# EasyEDA Pro project ReuseBlock_1_2024-11-17.epro

# Schematic 1
Create Date: 2024-03-08; Page Name: P1; Project Name: STC32F12K54母版; Schematic Name: Schematic3; Update Date: 2024-03-19; Company: 嘉立创EDA; Page Size: A4; Version: V1.0
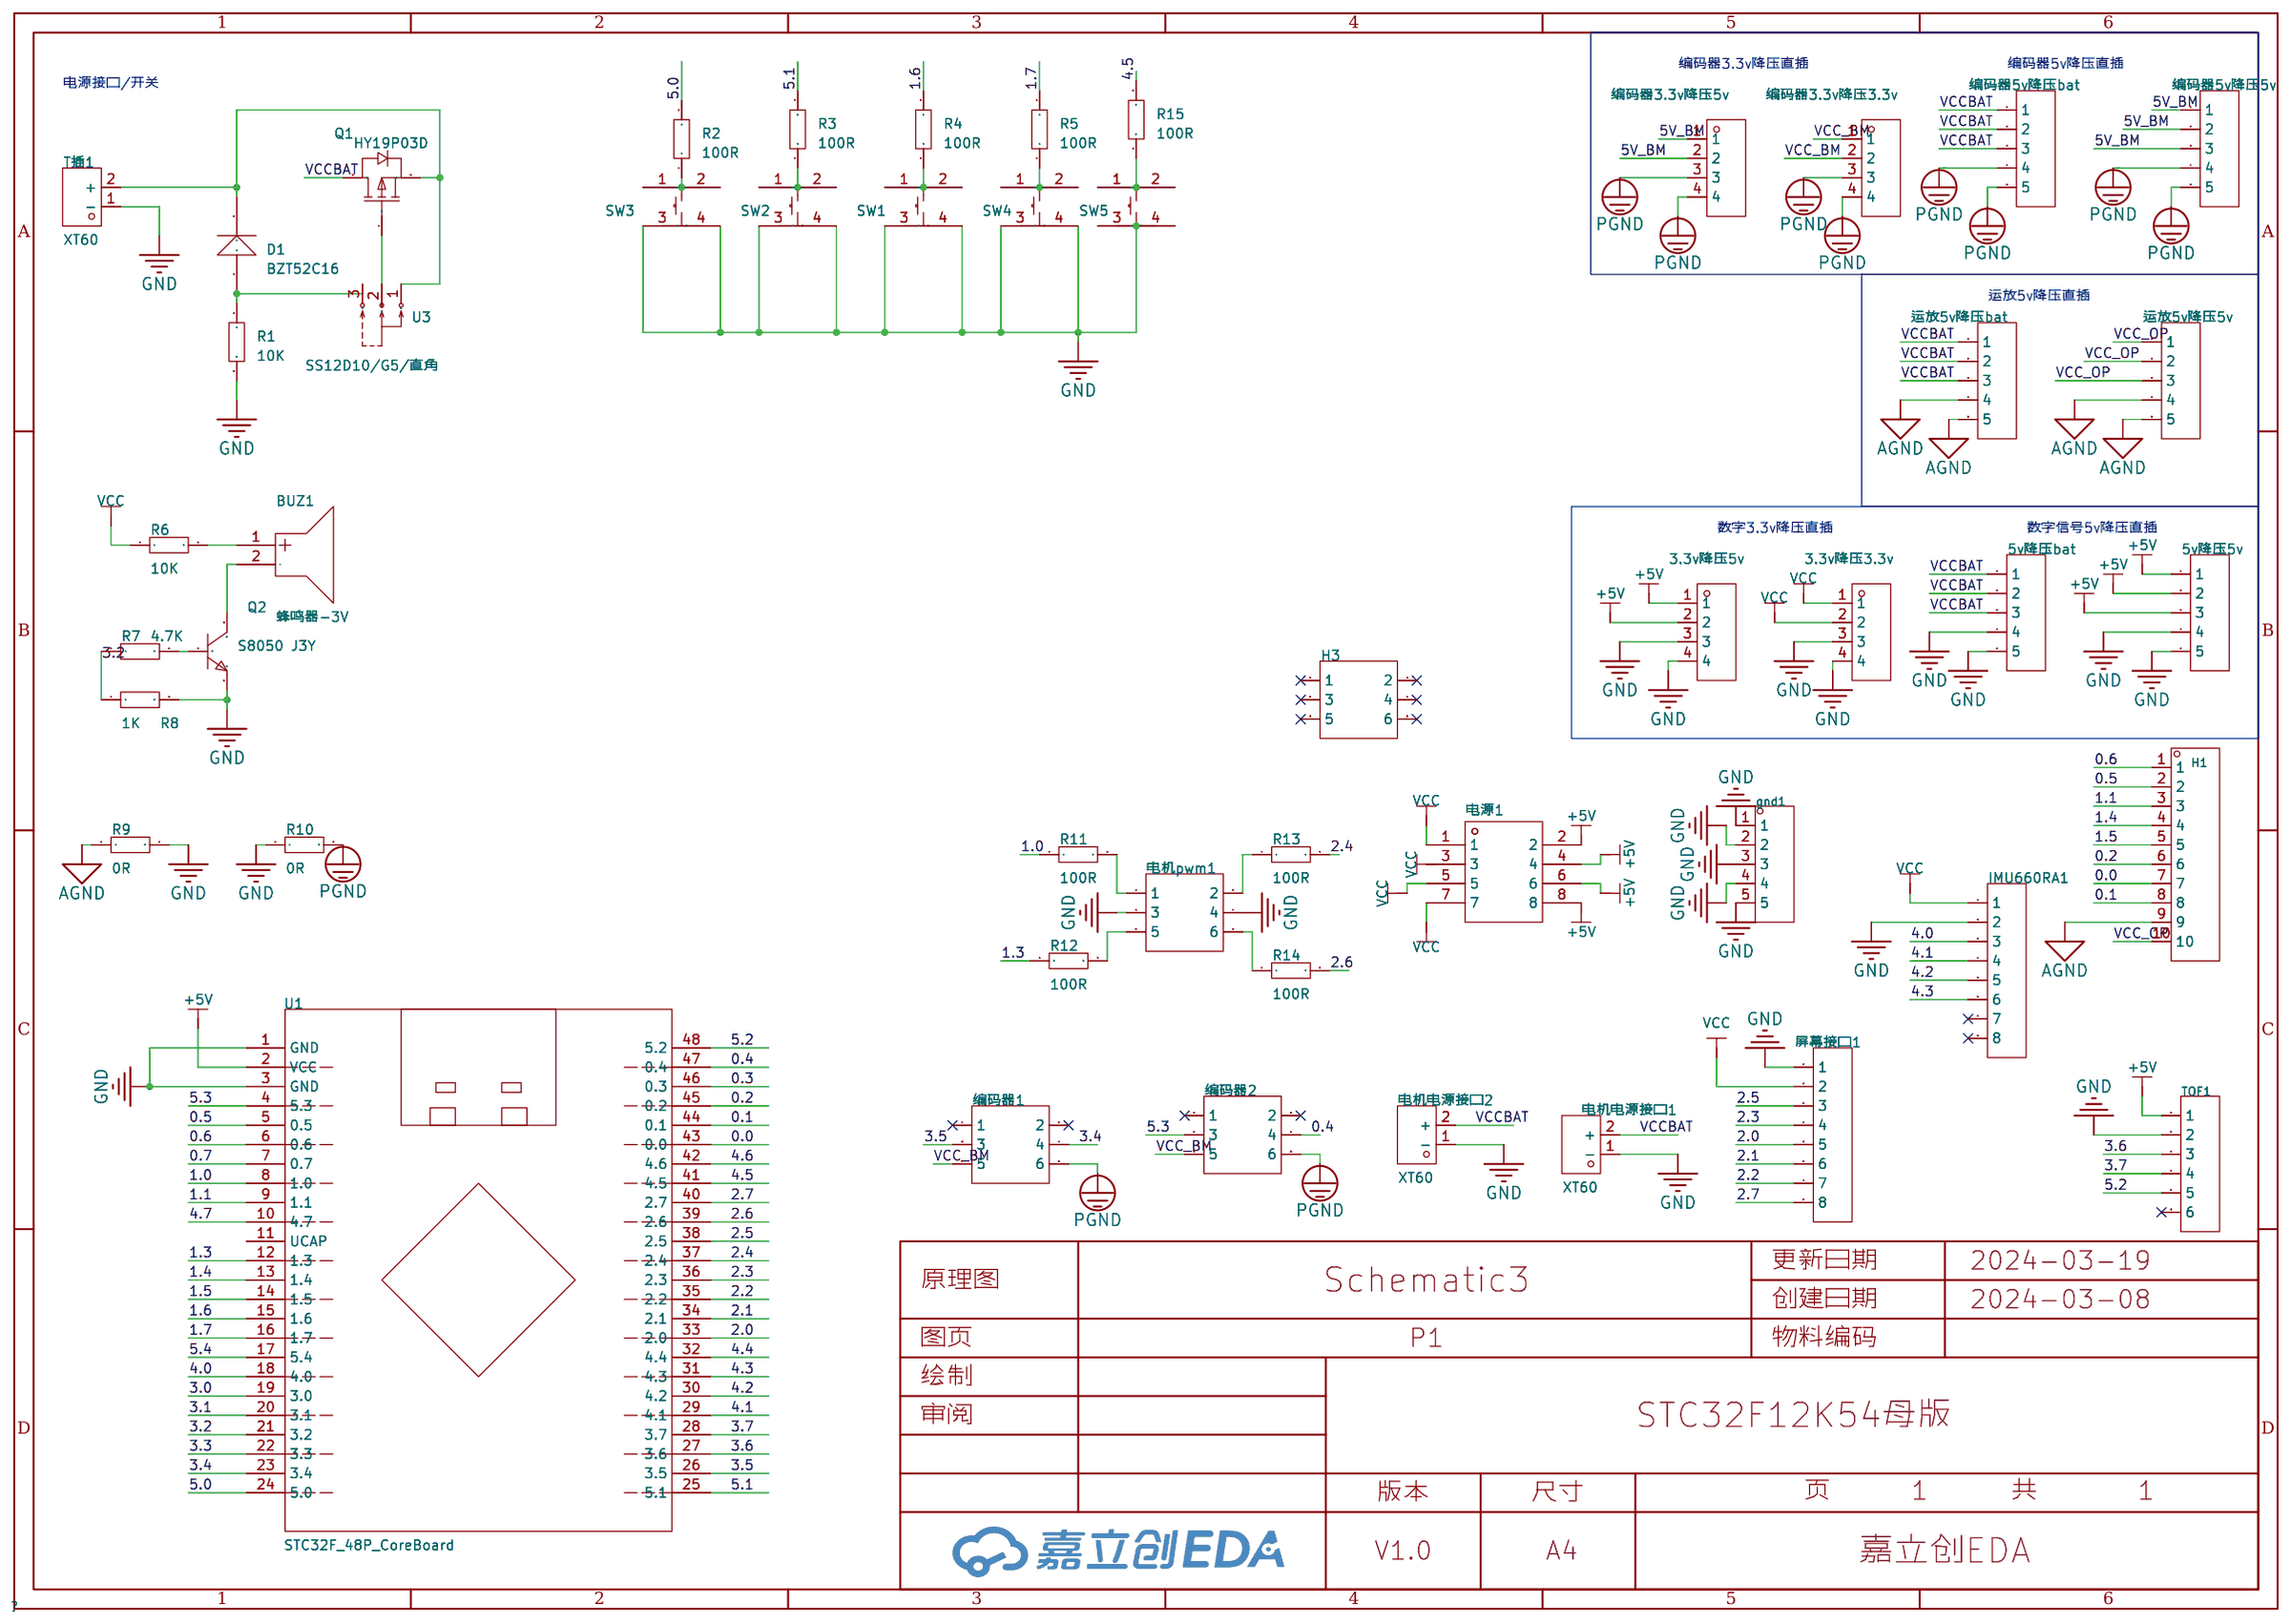
[diagram p0: schematic sheet]

## Parts
3.3v降压3.3v  -  [HDR-TH_4P-P2.54-V-F]
3.3v降压5v  -  [HDR-TH_4P-P2.54-V-F]
5v降压5v  -  [HDR-TH_5P-P2.54-V-F]
5v降压bat  -  [HDR-TH_5P-P2.54-V-F]
BUZ1  蜂鸣器-3V  [BUZ-TH_BD12.0-P7.60-D0.6-FD]
D1  BZT52C16  [SS14]
gnd1  -  [HDR-TH_5P-P2.54-V-M]
H1  -  [HDR-TH_10P-P2.54-V-M-1]
H3  -  [HDR-TH_6P-P2.54-V-R2-C3-S2.54_A2541WV-2X3P]
IMU660RA1  -  [HDR-TH_8P-P2.54-V-F-1]
Q1  HY19P03D  [TO-252-3_L6.5-W5.8-P4.58-BL]
Q2  S8050 J3Y  [SOT-23-3_L3.0-W1.7-P0.95-LS2.9-BR]
R1  10K  [R0603]
R2  100R  [R0603]
R3  100R  [R0603]
R4  100R  [R0603]
R5  100R  [R0603]
R6  10K  [R0603]
R7  4.7K  [R0603]
R8  1K  [R0603]
R9  0R  [R0603]
R10  0R  [R0603]
R11  100R  [R0603]
R12  100R  [R0603]
R13  100R  [R0603]
R14  100R  [R0603]
R15  100R  [R0603]
SW1  TS-1095S-A2B3-C2D1  [SW-SMD_4P-L6.0-W6.0-P4.50-LS8.5]
SW2  TS-1095S-A2B3-C2D1  [SW-SMD_4P-L6.0-W6.0-P4.50-LS8.5]
SW3  TS-1095S-A2B3-C2D1  [SW-SMD_4P-L6.0-W6.0-P4.50-LS8.5]
SW4  TS-1095S-A2B3-C2D1  [SW-SMD_4P-L6.0-W6.0-P4.50-LS8.5]
SW5  TS-1095S-A2B3-C2D1  [SW-SMD_4P-L6.0-W6.0-P4.50-LS8.5]
TOF1  -  [HDR-TH_6P-P2.54-V-M-1]
T插1  XT60  [CONN-TH_XT60]
U1  STC32F_48P_CoreBoard  [STC32F_48P]
U3  SS12D10/G5/直角  [SW-TH_SHOU-HAN_SS12D10G4]
屏幕接口1  -  [HDR-TH_8P-P2.54-V-F-1]
电机pwm1  -  [HDR-TH_6P-P2.54-V-R2-C3-S2.54_A2541WV-2X3P]
电机电源接口1  XT60  [CONN-TH_XT60]
电机电源接口2  XT60  [CONN-TH_XT60]
电源1  -  [HDR-TH_8P-P2.54-V-M-R2-C4-S2.54]
编码器1  -  [HDR-TH_6P-P2.54-V-R2-C3-S2.54_A2541WV-2X3P]
编码器2  -  [HDR-TH_6P-P2.54-V-R2-C3-S2.54_A2541WV-2X3P]
编码器3.3v降压3.3v  -  [HDR-TH_4P-P2.54-V-F]
编码器3.3v降压5v  -  [HDR-TH_4P-P2.54-V-F]
编码器5v降压5v  -  [HDR-TH_5P-P2.54-V-F]
编码器5v降压bat  -  [HDR-TH_5P-P2.54-V-F]
运放5v降压5v  -  [HDR-TH_5P-P2.54-V-F]
运放5v降压bat  -  [HDR-TH_5P-P2.54-V-F]

## Library data of the parts
3.3v降压3.3v 3.3v降压5v 编码器3.3v降压3.3v 编码器3.3v降压5v = HDR-F_2.54_1x4P: Supplier Part: C2718488; Supplier Footprint: 插件
5v降压5v 5v降压bat 编码器5v降压5v 编码器5v降压bat 运放5v降压5v 运放5v降压bat = HDR-F_2.54_1x5P: Supplier Part: C50950; Supplier Footprint: 插件
BUZ1 = 蜂鸣器-3V: Supplier Part: C9900021444; Supplier Footprint: BUZ-TH; JLCPCB Part Class: 扩展库; Supplier: LCSC
D1 = BZT52C16: Published: 8-Jun-2000; LatestRevisionDate: 17-Jul-2002; LatestRevisionNote: Re-released for DXP Platform.; DatasheetVersion: 1998; PackageVersion: Aug-1999; PackageReference: DO-41; Publisher: Altium Limited; Code_JEDEC: DO-204-AL; ComponentLink1Description: Manufacturer Link; ComponentLink1URL: http://www.fairchildsemi.com/; ComponentLink2Description: Datasheet; ComponentLink2URL: http://www.fairchildsemi.com/ds/1N%2F1N4001.pdf
gnd1 = HDR-M_2.54_1x5P: Supplier Part: C358687; Supplier Footprint: 插件
H1 = HDR-M_2.54_1x10P: Supplier Part: C57369; Supplier Footprint: 插件
H3 电机pwm1 编码器1 编码器2 = HDR-M_2.54_2x3: Supplier Part: C402781; Supplier Footprint: 插件,P=2.54mm
IMU660RA1 屏幕接口1 = HDR-F_2.54_1x8P: Supplier Part: C27438; Supplier Footprint: 插件
Q1 = HY19P03D_C330375: 漏源电压（Vdss）:-30V;连续漏极电流（Id）（25°C 时）:90A(Tc);栅源极阈值电压:3V @ 250uA;漏源导通电阻:6mΩ @ 45A,10V;最大功率耗散（Ta=25°C）:50W(Tc);类型:P沟道;; Supplier Part: C330375; Supplier Footprint: TO-252-2L; JLCPCB Part Class: 扩展库; Datasheet: https://atta.szlcsc.com/upload/public/pdf/source/20181108/C330375_BA5D69AA7EC063D0F6F0CEB9136BFE2D.pdf; Supplier: LCSC
Q2 = S8050 J3Y_C2146: 晶体管类型:NPN;集电极电流(Ic):500mA;集射极击穿电压(Vceo):25V;功率(Pd):300mW;直流电流增益(hFE@Ic,Vce):200@50mA,1V;; LCSC Part Name: S8050 J3Y(RANGE:200-350) H档(200-350); Supplier Part: C2146; Manufacturer: CJ(江苏长电/长晶); Supplier Footprint: SOT-23; JLCPCB Part Class: 基础库; Datasheet: https://atta.szlcsc.com/upload/public/pdf/source/20140809/1457707209234.pdf; Supplier: LCSC; Transistor Type: NPN; Collector Current (Ic): 500mA; Collector-Emitter Breakdown Voltage (Vceo): 25V; Power Dissipation (Pd): 300mW; DC Current Gain (hFE@Ic,Vce): 200@50mA,1V; Transition Frequency (fT): 150MHz; Collector Cut-Off Current (Icbo): 100nA; Collector-Emitter Saturation Voltage (VCE(sat)@Ic,Ib): 600mV@500mA,50mA
R1-R15 = Res_0603: Supplier Footprint: 0603
SW1-SW5 = TS-1095S-A2B3-C2D1: 电路结构:单刀单掷;按钮形状:圆形按钮;安装方式:-;开关长度:6mm;开关宽度:6mm;开关高度:4.5mm;带灯:-;机械寿命:-;; LCSC Part Name: 轻触开关6*6*4.5mm贴片四脚SMD黑柄250gf; Supplier Part: C493062; Manufacturer: Yuandi(元迪); JLCPCB Part Class: 扩展库; Datasheet: https://atta.szlcsc.com/upload/public/pdf/source/20200316/C493020_660A0B796DFD577DFFC16EBBCF440F36.pdf; Supplier: LCSC; Circuit: 单刀单掷; Actuator Style: 圆形按钮; Switch Length: 6mm; Switch Width: 6mm; Switch Height: 4.5mm
TOF1 = HDR-M_2.54_1x6P: Supplier Part: C37208; Supplier Footprint: 插件
T插1 电机电源接口1 电机电源接口2 = XT60: Supplier: LCSC; Supplier Part: C98733; Manufacturer: AMASS(艾迈斯); link: https://atta.szlcsc.com/upload/public/pdf/source/20170606/1496716524919.pdf; JLCPCB Part Class: 扩展库
U1 = STC32F_48P_CoreBoard: 逐飞科技STC32F核心板; Library Name: STC32F12K_核心板整体封装_V1.0
U3 = SS12D10/G5/直角: Supplier Part: C9900029541; Supplier Footprint: THrough hole; JLCPCB Part Class: 扩展库; Supplier: LCSC
电源1 = HDR-M_2.54_2x4: Supplier Part: C124386; Supplier Footprint: 插件,P=2.54mm

## Nets
5V_BM: 编码器3.3v降压5v.1 编码器3.3v降压5v.2 编码器5v降压5v.1 编码器5v降压5v.2 编码器5v降压5v.3
+5V: 3.3v降压5v.1 3.3v降压5v.2 5v降压5v.1 5v降压5v.2 5v降压5v.3 TOF1.1 U1.2(VCC) 电源1.2 电源1.4 电源1.6 电源1.8
AGND: H1.9 R9.1 运放5v降压5v.4 运放5v降压5v.5 运放5v降压bat.4 运放5v降压bat.5
GND: 3.3v降压3.3v.3 3.3v降压3.3v.4 3.3v降压5v.3 3.3v降压5v.4 5v降压5v.4 5v降压5v.5 5v降压bat.4 5v降压bat.5 gnd1.1 gnd1.2 gnd1.3 gnd1.4 gnd1.5 IMU660RA1.2 Q2.2(E) R1.2 R8.2 R9.2 R10.1 SW1.3 SW1.4 SW2.3 SW2.4 SW3.3 SW3.4 SW4.3 SW4.4 SW5.3 SW5.4 TOF1.2 T插1.1(-) U1.1(GND) U1.3(GND) 屏幕接口1.1 电机pwm1.3 电机pwm1.4 电机电源接口1.1(-) 电机电源接口2.1(-)
PGND: R10.2 编码器1.6 编码器2.6 编码器3.3v降压3.3v.3 编码器3.3v降压3.3v.4 编码器3.3v降压5v.3 编码器3.3v降压5v.4 编码器5v降压5v.4 编码器5v降压5v.5 编码器5v降压bat.4 编码器5v降压bat.5
VCC: 3.3v降压3.3v.1 3.3v降压3.3v.2 IMU660RA1.1 R6.1 屏幕接口1.2 电源1.1 电源1.3 电源1.5 电源1.7
VCC_BM: 编码器1.5 编码器2.5 编码器3.3v降压3.3v.1 编码器3.3v降压3.3v.2
VCC_OP: H1.10 运放5v降压5v.1 运放5v降压5v.2 运放5v降压5v.3
VCCBAT: 5v降压bat.1 5v降压bat.2 5v降压bat.3 Q1.2(D) 电机电源接口1.2(+) 电机电源接口2.2(+) 编码器5v降压bat.1 编码器5v降压bat.2 编码器5v降压bat.3 运放5v降压bat.1 运放5v降压bat.2 运放5v降压bat.3
0.0: H1.7 U1.43(0.0)
0.1: H1.8 U1.44(0.1)
0.2: H1.6 U1.45(0.2)
0.3: U1.46(0.3)
0.4: U1.47(0.4) 编码器2.4
0.5: H1.2 U1.5(0.5)
0.6: H1.1 U1.6(0.6)
0.7: U1.7(0.7)
1.0: R11.1 U1.8(1.0)
1.1: H1.3 U1.9(1.1)
1.3: R12.1 U1.12(1.3)
1.4: H1.4 U1.13(1.4)
1.5: H1.5 U1.14(1.5)
1.6: R4.2 U1.15(1.6)
1.7: R5.2 U1.16(1.7)
2.0: U1.33(2.0) 屏幕接口1.5
2.1: U1.34(2.1) 屏幕接口1.6
2.2: U1.35(2.2) 屏幕接口1.7
2.3: U1.36(2.3) 屏幕接口1.4
2.4: R13.2 U1.37(2.4)
2.5: U1.38(2.5) 屏幕接口1.3
2.6: R14.2 U1.39(2.6)
2.7: U1.40(2.7) 屏幕接口1.8
3.0: U1.19(3.0)
3.1: U1.20(3.1)
3.2: R7.1 R8.1 U1.21(3.2)
3.3: U1.22(3.3)
3.4: U1.23(3.4) 编码器1.4
3.5: U1.26(3.5) 编码器1.3
3.6: TOF1.3 U1.27(3.6)
3.7: TOF1.4 U1.28(3.7)
4.0: IMU660RA1.3 U1.18(4.0)
4.1: IMU660RA1.4 U1.29(4.1)
4.2: IMU660RA1.5 U1.30(4.2)
4.3: IMU660RA1.6 U1.31(4.3)
4.4: U1.32(4.4)
4.5: R15.2 U1.41(4.5)
4.6: U1.42(4.6)
4.7: U1.10(4.7)
5.0: R2.2 U1.24(5.0)
5.1: R3.2 U1.25(5.1)
5.2: TOF1.5 U1.48(5.2)
5.3: U1.4(5.3) 编码器2.3
5.4: U1.17(5.4)
$1N2243: Q1.1(G) U3.2
$1N2244: D1.1(A) R1.1 U3.3
$1N2245: D1.2(K) Q1.3(S) T插1.2(+) U3.1
$1N2280: R2.1 SW3.1 SW3.2
$1N2281: R3.1 SW2.1 SW2.2
$1N2282: R4.1 SW1.1 SW1.2
$1N2283: R5.1 SW4.1 SW4.2
$1N2297: BUZ1.1(+) R6.2
$1N2298: BUZ1.2(-) Q2.3(C)
$1N2299: Q2.1(B) R7.2
$1N3556: R13.1 电机pwm1.2
$1N3560: R11.2 电机pwm1.1
$1N3578: R12.2 电机pwm1.5
$1N3591: R14.1 电机pwm1.6
$1N3733: R15.1 SW5.1 SW5.2

Not connected (* = marked no-connect by the designer): H3 1* 2* 3* 4* 5* 6*; IMU660RA1 7* 8*; TOF1 6*; U1 11(UCAP); 编码器1 1* 2*; 编码器2 1* 2*

## Notes on the sheet
- 电源接口/开关
- 编码器3.3v降压直插
- 编码器5v降压直插
- 运放5v降压直插
- 数字3.3v降压直插
- 数字信号5v降压直插

# Board 1
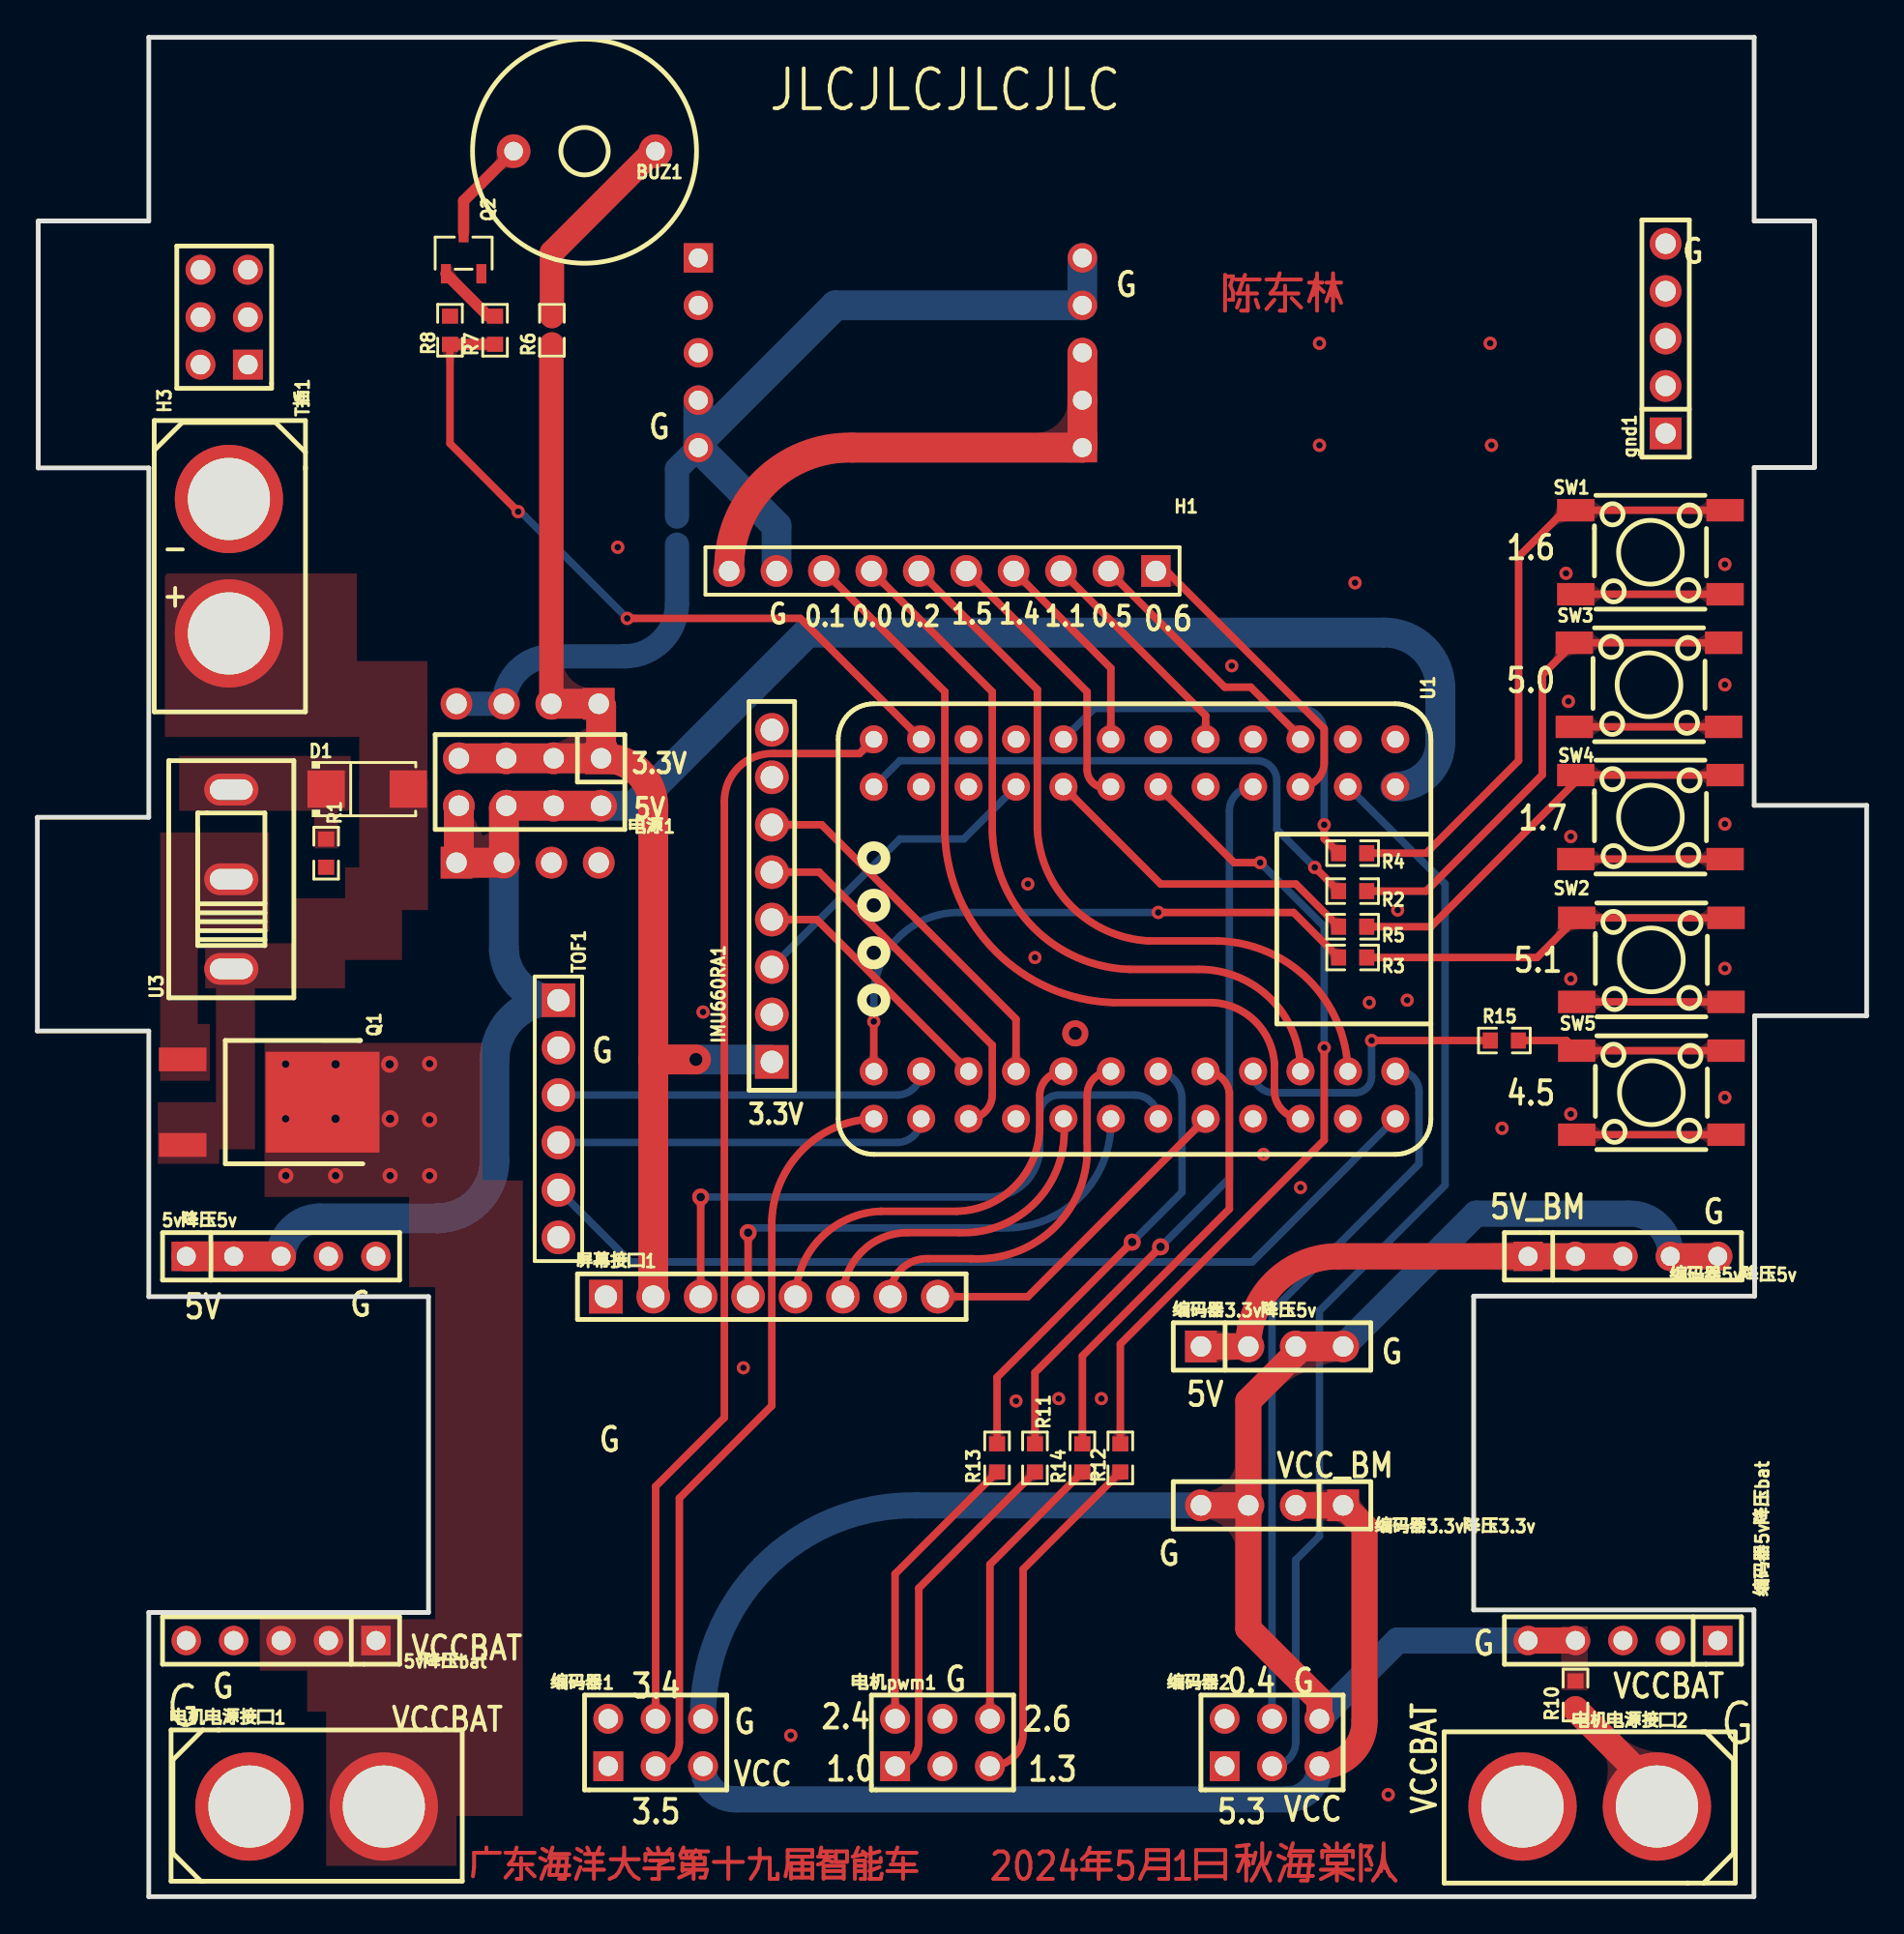
[diagram p1: board, top side]
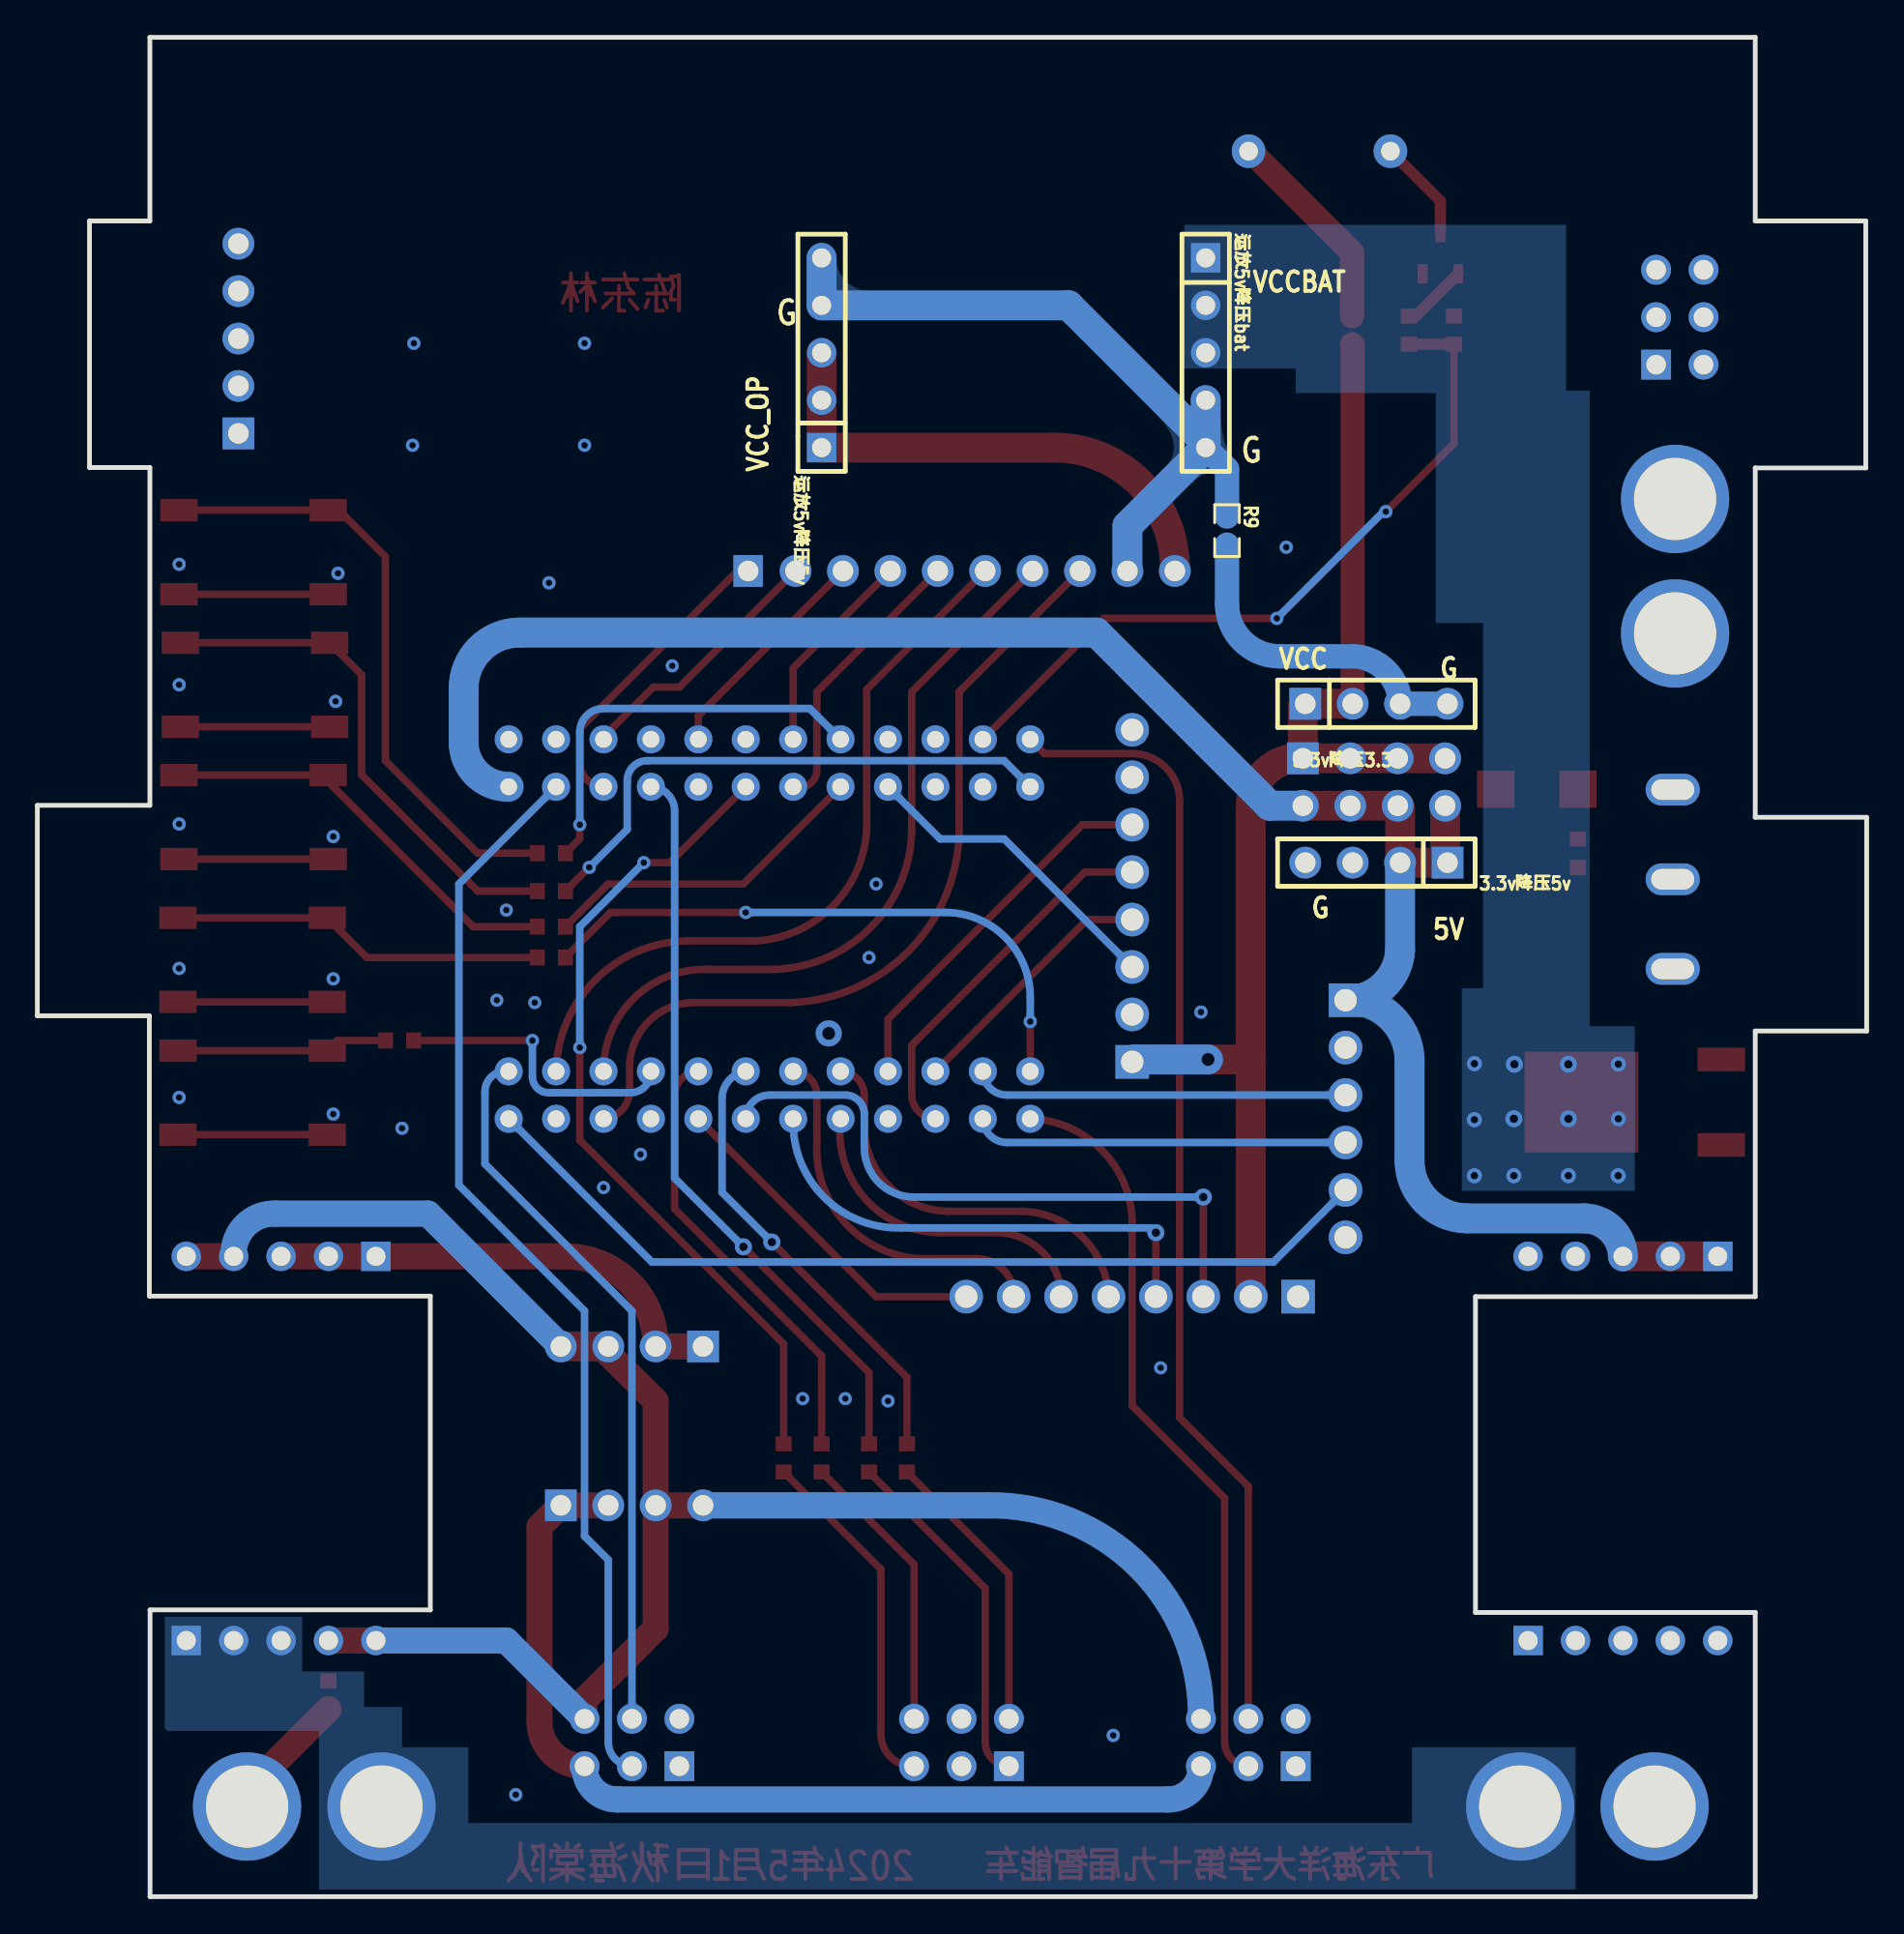
[diagram p2: board, bottom side, seen from below]

Outline 98 x 99.57 mm; copper layers: Top Layer, Bottom Layer. Coordinates in mm from the lower left corner of the outline.
Outline path: 0,57.8 5.97,57.8 5.97,76.51 0.05,76.51 0.05,89.73 5.97,89.73 5.97,99.57 91.97,99.57 91.97,89.73 95.2,89.73 95.2,76.53 91.97,76.53 91.97,58.44 98,58.44 98,47.17 92,47.17 92,32.16 76.94,32.16 76.94,15.36 91.96,15.36 91.96,0 5.97,0 5.97,15.22 20.95,15.22 20.95,32.13 5.97,32.13 5.97,46.36 0,46.36 0,57.8
Stack: Top Layer 0.035mm / Dielectric1 1.51mm FR4 er 4.5 / Bottom Layer 0.035mm

## Design rules (mm)
template: JLCPCB Capability(Two Layers Board)
spacing copperThickness1oz (default): track to track 0.102, other pairs 0.152 to 0.3
spacing copperThickness2oz: track to track 0.203, other pairs 0.152 to 0.3
track width copperThickness1oz (default): min 0.127, default 0.254, max 2.54
track width copperThickness2oz: min 0.203, default 0.254, max 2.54
differential pair differentialPair (default): width min 0.127, default 0.254, max 2.54; gap min 0.152, default 0.152
via viaSize (default): diameter min 0.5, default 0.61, max 10; hole min 0.3, default 0.305, max 6.3

## Placement (name value [footprint] x y rotation side)
3.3v降压3.3v  -  [HDR-TH_4P-P2.54-V-F]  26.27 63.88 180 bottom
3.3v降压5v  -  [HDR-TH_4P-P2.54-V-F]  26.27 55.37 0 bottom
5v降压5v  -  [HDR-TH_5P-P2.54-V-F]  13.06 34.29 0 top
5v降压bat  -  [HDR-TH_5P-P2.54-V-F]  13.06 13.72 180 top
BUZ1  蜂鸣器-3V  [BUZ-TH_BD12.0-P7.60-D0.6-FD]  29.31 93.47 180 top
D1  BZT52C16  [SS14]  15.47 73.03 0 top
gnd1  -  [HDR-TH_5P-P2.54-V-M]  87.23 83.44 90 top
H1  -  [HDR-TH_10P-P2.54-V-M-1]  48.49 70.99 180 top
H3  -  [HDR-TH_6P-P2.54-V-R2-C3-S2.54_A2541WV-2X3P]  10.01 84.58 90 top
IMU660RA1  -  [HDR-TH_8P-P2.54-V-F-1]  39.35 53.59 90 top
Q1  HY19P03D  [TO-252-3_L6.5-W5.8-P4.58-BL]  11.53 42.55 270 top
Q2  S8050 J3Y  [SOT-23-3_L3.0-W1.7-P0.95-LS2.9-BR]  22.84 88.01 270 top
R1  10K  [R0603]  15.47 55.88 270 top
R2  100R  [R0603]  70.46 53.85 180 top
R3  100R  [R0603]  70.46 50.29 180 top
R4  100R  [R0603]  70.46 55.88 180 top
R5  100R  [R0603]  70.46 51.94 180 top
R6  10K  [R0603]  27.57 83.88 90 top
R7  4.7K  [R0603]  24.52 83.88 90 top
R8  1K  [R0603]  22.11 83.88 90 top
R9  0R  [R0603]  34.27 73.15 270 bottom
R10  0R  [R0603]  82.4 10.8 90 top
R11  100R  [R0603]  53.44 23.5 270 top
R12  100R  [R0603]  58.02 23.5 270 top
R13  100R  [R0603]  51.41 23.5 90 top
R14  100R  [R0603]  55.98 23.5 90 top
R15  100R  [R0603]  78.59 45.85 180 top
SW1  TS-1095S-A2B3-C2D1  [SW-SMD_4P-L6.0-W6.0-P4.50-LS8.5]  86.41 72 0 top
SW2  TS-1095S-A2B3-C2D1  [SW-SMD_4P-L6.0-W6.0-P4.50-LS8.5]  86.46 50.17 0 top
SW3  TS-1095S-A2B3-C2D1  [SW-SMD_4P-L6.0-W6.0-P4.50-LS8.5]  86.34 64.9 0 top
SW4  TS-1095S-A2B3-C2D1  [SW-SMD_4P-L6.0-W6.0-P4.50-LS8.5]  86.41 57.81 0 top
SW5  TS-1095S-A2B3-C2D1  [SW-SMD_4P-L6.0-W6.0-P4.50-LS8.5]  86.46 43.05 0 top
TOF1  -  [HDR-TH_6P-P2.54-V-M-1]  27.92 41.66 270 top
T插1  XT60  [CONN-TH_XT60]  10.26 71.25 270 top
U1  STC32F_48P_CoreBoard  [STC32F_48P]  58.78 51.82 270 top
U3  SS12D10/G5/直角  [SW-TH_SHOU-HAN_SS12D10G4]  10.39 54.48 90 top
屏幕接口1  -  [HDR-TH_8P-P2.54-V-F-1]  39.35 32.13 0 top
电机pwm1  -  [HDR-TH_6P-P2.54-V-R2-C3-S2.54_A2541WV-2X3P]  48.49 8.25 0 top
电机电源接口1  XT60  [CONN-TH_XT60]  14.96 4.83 0 top
电机电源接口2  XT60  [CONN-TH_XT60]  83.16 4.83 180 top
电源1  -  [HDR-TH_8P-P2.54-V-M-R2-C4-S2.54]  26.39 59.69 180 top
编码器1  -  [HDR-TH_6P-P2.54-V-R2-C3-S2.54_A2541WV-2X3P]  33.12 8.25 0 top
编码器2  -  [HDR-TH_6P-P2.54-V-R2-C3-S2.54_A2541WV-2X3P]  66.14 8.25 0 top
编码器3.3v降压3.3v  -  [HDR-TH_4P-P2.54-V-F]  66.14 20.96 180 top
编码器3.3v降压5v  -  [HDR-TH_4P-P2.54-V-F]  66.14 29.46 0 top
编码器5v降压5v  -  [HDR-TH_5P-P2.54-V-F]  84.94 34.29 0 top
编码器5v降压bat  -  [HDR-TH_5P-P2.54-V-F]  84.94 13.72 180 top
运放5v降压5v  -  [HDR-TH_5P-P2.54-V-F]  55.98 82.68 90 bottom
运放5v降压bat  -  [HDR-TH_5P-P2.54-V-F]  35.41 82.68 270 bottom

## Footprints (pads in the part's own frame, mm; a bottom-side part is the same pattern mirrored in y, then rotated)
BUZ-TH_BD12.0-P7.60-D0.6-FD
  round 1.8 hole 1: 1(-3.8,0) 2(3.8,0)
CONN-TH_XT60
  round 5.8 hole 4.4: 1(-3.6,0) 2(3.6,0)
HDR-TH_4P-P2.54-V-F
  rect 1.7x1.7 hole 1.1: 1(-3.81,0)
  round 1.7 hole 1.1: 2(-1.27,0) 3(1.27,0) 4(3.81,0)
HDR-TH_5P-P2.54-V-F
  rect 1.575x1.575 hole 1.02: 1(-5.08,0)
  round 1.575 hole 1.02: 2(-2.54,0) 3(0,0) 4(2.54,0) 5(5.08,0)
HDR-TH_5P-P2.54-V-M
  rect 1.7x1.7 hole 1.1: 1(-5.08,0)
  round 1.7 hole 1.1: 2(-2.54,0) 3(0,0) 4(2.54,0) 5(5.08,0)
HDR-TH_6P-P2.54-V-M-1
  rect 1.8x1.8 hole 1.2: 1(-6.35,0)
  round 1.8 hole 1.2: 2(-3.81,0) 3(-1.27,0) 4(1.27,0) 5(3.81,0) 6(6.35,0)
HDR-TH_6P-P2.54-V-R2-C3-S2.54_A2541WV-2X3P
  rect 1.6x1.6 hole 1.05: 1(-2.54,-1.27)
  round 1.6 hole 1.05: 2(-2.54,1.27) 3(0,-1.27) 4(0,1.27) 5(2.54,-1.27) 6(2.54,1.27)
HDR-TH_8P-P2.54-V-F-1
  rect 1.8x1.8 hole 1.2: 1(-8.89,0)
  round 1.8 hole 1.2: 2(-6.35,0) 3(-3.81,0) 4(-1.27,0) 5(1.27,0) 6(3.81,0) 7(6.35,0) 8(8.89,0)
HDR-TH_8P-P2.54-V-M-R2-C4-S2.54
  rect 1.7x1.7 hole 1.1: 1(-3.81,-1.27)
  round 1.7 hole 1.1: 2(-3.81,1.27) 3(-1.27,-1.27) 4(-1.27,1.27) 5(1.27,-1.27) 6(1.27,1.27) 7(3.81,-1.27) 8(3.81,1.27)
HDR-TH_10P-P2.54-V-M-1
  rect 1.575x1.7 hole 1.1: 1(-11.43,0)
  round 1.7 hole 1.1: 2(-8.89,0) 3(-6.35,0) 4(-3.81,0) 5(-1.27,0) 6(1.27,0) 7(3.81,0) 8(6.35,0) 9(8.89,0) 10(11.43,0)
R0603
  rect 0.806x0.864 smd: 1(-0.753,0) 2(0.753,0)
SOT-23-3_L3.0-W1.7-P0.95-LS2.9-BR
  rect 1.038x0.532 smd: 1(1.101,-0.95) 2(1.101,0.95) 3(-1.101,0)
SS14
  rect 2x2 smd: 1(0,-13.716) 2(4.4,-13.716)
STC32F_48P
  round 1.5 hole 0.9: 1(-10.16,13.97) 2(-7.62,13.97) 3(-10.16,11.43) 4(-7.62,11.43) 5(-10.16,8.89) 6(-7.62,8.89) 7(-10.16,6.35) 8(-7.62,6.35) 9(-10.16,3.81) 10(-7.62,3.81) 11(-10.16,1.27) 12(-7.62,1.27) 13(-10.16,-1.27) 14(-7.62,-1.27) 15(-10.16,-3.81) 16(-7.62,-3.81) 17(-10.16,-6.35) 18(-7.62,-6.35) 19(-10.16,-8.89) 20(-7.62,-8.89) 21(-10.16,-11.43) 22(-7.62,-11.43) 23(-10.16,-13.97) 24(-7.62,-13.97) 25(7.62,-13.97) 26(10.16,-13.97) 27(7.62,-11.43) 28(10.16,-11.43) 29(7.62,-8.89) 30(10.16,-8.89) 31(7.62,-6.35) 32(10.16,-6.35) 33(7.62,-3.81) 34(10.16,-3.81) 35(7.62,-1.27) 36(10.16,-1.27) 37(7.62,1.27) 38(10.16,1.27) 39(7.62,3.81) 40(10.16,3.81) 41(7.62,6.35) 42(10.16,6.35) 43(7.62,8.89) 44(10.16,8.89) 45(7.62,11.43) 46(10.16,11.43) 47(7.62,13.97) 48(10.16,13.97)
SW-SMD_4P-L6.0-W6.0-P4.50-LS8.5
  rect 2x1.2 smd: 1(-4,2.25) 2(4,2.25) 3(-4,-2.25) 4(4,-2.25)
SW-TH_SHOU-HAN_SS12D10G4
  oval 1.7x2.9 hole 1.1x2.3: 1(-4.8,0) 2(0,0) 3(4.8,0)
TO-252-3_L6.5-W5.8-P4.58-BL
  rect 1.27x2.54 smd: 1(-2.288,-3.747) 3(2.288,-3.745)
  rect 5.4x6.1 smd: 2(-0.002,3.747)

## Nets
As in the schematic.

Pads without a net: H3 1 2 3 4 5 6; IMU660RA1 7 8; TOF1 6; U1 11; 编码器1 1 2; 编码器2 1 2

## Via types
v1: diameter 0.71, hole 0.355, Top Layer to Bottom Layer, 29 vias
v2: diameter 0.91, hole 0.455, Top Layer to Bottom Layer, 8 vias
v3: diameter 1.4, hole 0.7, Top Layer to Bottom Layer, 2 vias
v4: diameter 0.7, hole 0.35, Top Layer to Bottom Layer, 12 vias
v5: diameter 0.81, hole 0.405, Top Layer to Bottom Layer, 8 vias

## Routing (per net, layer and track width the routed paths; a pad name or vN(x,y) marks a point on that pad's centre or on a via; arc(x,y) is an arc through that point)
5V_BM: length 25.4
  Top Layer w1.4: 编码器5v降压5v.3 编码器5v降压5v.2 编码器5v降压5v.1 69.7,34.29 arc(66.28,32.88) 编码器3.3v降压5v.2 编码器3.3v降压5v.1
+5V: length 110.1
  Top Layer w1.6: 电源1.2 电源1.4 电源1.6 24.99,58.29 3.3v降压5v.2 3.3v降压5v.1 22.58,55.5 电源1.8 ; 7.98,34.29 5v降压5v.2 5v降压5v.3
  Bottom Layer w1.6: 5v降压5v.3 arc(13.67,35.71) 15.09,36.32 21.44,36.32 arc(23.58,37.23) 24.49,39.37 24.49,44.83 arc(25.53,47.14) TOF1.1 arc(25.91,48.74) 24.99,50.67 3.3v降压5v.2 ; U1.2 arc(74.46,60.13) 75.16,61.85 75.16,64.64 arc(74.29,66.82) 72.11,67.69 41.25,67.69 31.98,58.42 电源1.2
AGND: length 41.2
  Bottom Layer w1.3: R9.1 34.27,76.45 运放5v降压bat.5
  Bottom Layer w1.6: H1.9 39.6,73.41 运放5v降压bat.5 35.41,77.87 ; 运放5v降压5v.5 运放5v降压5v.4 42.75,85.22 35.41,77.87 ; 35.41,77.87 运放5v降压bat.4
GND: length 65
  Top Layer w0.4: SW3.3 SW3.4 ; SW1.3 SW1.4 ; SW5.3 SW5.4 ; SW4.3 SW4.4 ; SW2.3 SW2.4
  Top Layer w1.4: R10.1 86.76,5.68 电机电源接口2.1
  Bottom Layer w1.3: 27.53,66.42 arc(25.75,65.66) 3.3v降压3.3v.3 3.3v降压3.3v.4 ; R9.2 34.27,69.22 arc(33.44,67.25) 31.47,66.42 27.53,66.42
  vias: v1(31.09,72.26) v1(35.66,47.37) v1(40.36,8.64) v1(68.68,83.19) v1(68.68,77.72) v1(70.59,70.36) v1(72.37,5.46) v1(77.83,83.19) v1(77.9,77.72) v1(78.46,41.15) v1(81.89,70.87) v1(82.02,64.01) v1(82.14,56.77) v1(82.14,49.15) v1(82.14,41.91) v1(90.4,71.35) v1(90.4,64.9) v1(90.4,57.44) v1(90.4,49.71) v1(90.4,42.8) v4(37.82,28.32) v4(52.43,26.54) v4(53.06,54.23) v4(53.44,50.29) v4(54.71,26.67) v4(57,26.67) v4(63.98,65.91) v4(65.68,39.75) v4(67.67,37.97) v4(71.35,47.88) v4(72.87,52.83) v4(73.38,48.01) v3(55.6,46.23)
PGND: length 100.8
  Top Layer w1.4: 编码器3.3v降压3.3v.3 64.87,26.54 67.41,29.08 编码器3.3v降压5v.3 ; 编码器3.3v降压3.3v.3 64.87,14.35 68.68,10.54 68.68,9.53 ; 编码器3.3v降压3.3v.3 编码器3.3v降压3.3v.4 ; 编码器5v降压bat.5 编码器5v降压bat.4 ; 编码器5v降压5v.4 编码器5v降压5v.5
  Top Layer w1.6: 编码器3.3v降压5v.3 编码器3.3v降压5v.4
  Bottom Layer w1.4: 编码器1.6 arc(38.95,17.66) 47.09,20.96 编码器3.3v降压3.3v.4 ; 编码器5v降压5v.4 arc(86.85,35.95) 85.19,36.58 77.06,36.58 编码器3.3v降压5v.4 ; 编码器5v降压bat.5 72.87,13.72 68.68,9.53
VCC: length 69.3
  Top Layer w1.3: R6.1 27.53,83.1 3.3v降压3.3v.2
  Top Layer w1.6: 30.2,60.96 arc(32.24,60.2) 33,58.17 33,44.83 ; 30.2,60.96 22.58,60.96 ; 30.2,60.96 30.2,63.75 3.3v降压3.3v.1 3.3v降压3.3v.2 ; 33,44.83 屏幕接口1.2 ; 33,44.83 v3(35.28,44.83)
  Bottom Layer w1.6: v3(35.28,44.83) 39.22,44.83 IMU660RA1.1
VCC_BM: length 53.5
  Top Layer w1.4: 68.68,6.99 arc(70.4,7.68) 71.1,9.4 71.1,19.81 编码器3.3v降压3.3v.1 编码器3.3v降压3.3v.2
  Bottom Layer w1.4: 编码器1.5 arc(36.17,5.71) 37.44,5.21 66.9,5.21 arc(68.18,5.71) 68.68,6.99
VCC_OP: length 27.8
  Top Layer w1.6: H1.10 arc(38.95,75.71) 43.66,77.6 运放5v降压5v.1 运放5v降压5v.2 运放5v降压5v.3
VCCBAT:
  vias: v2(15.98,44.58) v2(15.97,41.66) v2(18.87,44.58) v2(18.9,41.66) v5(13.3,44.58) v5(13.3,41.66) v5(13.31,38.61) v5(15.98,38.61) v5(18.9,38.61) v5(21.01,44.61) v5(21.01,41.61) v5(21.01,38.61)
0.0: length 40.4
  Top Layer w0.4: U1.43 arc(66.08,48.07) 62.21,49.66 58.52,49.66 arc(53.38,51.88) 51.16,57.02 51.16,64.52 H1.7
0.1: length 44.9
  Top Layer w0.4: U1.44 arc(66.71,42.1) 66.27,43.05 66.27,44.61 arc(65.25,46.86) 63,47.88 57.63,47.88 arc(51.35,50.61) 48.62,56.9 48.62,64.52 H1.8
0.2: length 40.3
  Top Layer w0.4: U1.45 arc(68.11,49.09) 63.22,51.18 59.54,51.18 arc(55.41,53.02) 53.57,57.15 53.57,64.64 H1.6
0.4: length 39.1
  Bottom Layer w0.4: 72.87,44.2 U1.47 arc(73.65,43.93) 74.02,43.05 74.02,39.24 66.14,31.37 编码器2.4 65.89,9.53
0.5: length 14.1
  Top Layer w0.4: H1.2 63.6,64.77 65,64.77 67.67,62.1 U1.5
0.6: length 16.3
  Top Layer w0.4: U1.6 arc(68.56,59.82) 68.94,60.71 68.94,62.54 60.49,70.99 H1.1
1.0: length 40.2
  Top Layer w0.4: v2(60.17,34.8) 53.44,28.07 R11.1
  Bottom Layer w0.4: U1.8 arc(64.24,59.05) 63.86,58.17 63.86,38.48 v2(60.17,34.8)
1.1: length 12.2
  Top Layer w0.4: U1.9 62.59,63.25 H1.3
1.3: length 44.2
  Top Layer w0.4: v1(65.51,55.37) 64.11,55.37 U1.12 ; v1(68.94,45.47) 68.94,40.51 58.02,29.59 R12.1
  Bottom Layer w0.4: v1(68.94,45.47) 68.94,51.94 v1(65.51,55.37)
1.4: length 11.2
  Top Layer w0.4: H1.4 57.51,65.79 U1.13
1.5: length 15.5
  Top Layer w0.4: H1.5 56.24,64.52 56.24,60.33 arc(56.65,59.56) U1.14 57.13,59.44
1.6: length 22.2
  Top Layer w0.4: v1(68.94,57.4) 68.94,56.65 R4.2
  Bottom Layer w0.4: 68.94,62.33 arc(68.57,63.25) 67.67,63.63 56.62,63.63 U1.15 ; 68.94,62.36 v1(68.94,57.4)
1.7: length 17.8
  Top Layer w0.4: U1.16 60.17,54.23 67.42,54.23 R5.2
2.0: length 22.3
  Top Layer w0.4: 屏幕接口1.5 arc(42,35.32) 45.19,36.7 49.25,36.7 arc(52.36,38.04) 53.7,41.15 53.7,42.93 arc(54.08,43.81) U1.33 54.97,43.81
2.1: length 18.1
  Top Layer w0.4: 屏幕接口1.6 arc(44.17,34.54) 46.58,35.56 49.38,35.56 arc(53.59,37.31) U1.34 54.97,41.15
2.2: length 20
  Top Layer w0.4: 屏幕接口1.7 arc(46.27,33.59) 47.73,34.16 50.03,34.16 arc(54.53,35.87) 56.24,40.37 56.24,42.93 arc(56.61,43.82) U1.35
2.3: length 26.4
  Top Layer w0.4: v2(38.08,35.56) 屏幕接口1.4
  Bottom Layer w0.4: U1.36 arc(55.86,37.46) 51.67,35.81 38.33,35.81 v2(38.08,35.56)
2.4: length 24.8
  Top Layer w0.4: R13.2 51.41,27.81 v2(58.65,35.05)
  Bottom Layer w0.4: v2(58.65,35.05) 61.32,37.72 61.32,42.8 arc(60.93,43.73) U1.37 60.05,44.07
2.5: length 34.5
  Top Layer w0.4: v2(35.54,37.47) 屏幕接口1.3
  Bottom Layer w0.4: U1.38 arc(59.68,42.55) 58.78,42.93 54.68,42.93 arc(54,42.63) 53.7,41.95 53.7,40.13 arc(52.92,38.24) 51.03,37.47 v2(35.54,37.47)
2.6: length 24
  Top Layer w0.4: 63.86,43.08 arc(63.42,43.86) U1.39 62.71,44.2 ; 63.86,43.05 63.86,36.83 55.98,28.96 R14.2
2.7: length 18.3
  Top Layer w0.4: U1.40 53.06,32.13 屏幕接口1.8
3.2: length 39.5
  Top Layer w0.4: R8.1 22.11,77.82 v1(25.76,74.17) ; U1.21 40.87,68.45 v1(31.6,68.45)
  Top Layer w0.6: R8.1 R7.1
  Bottom Layer w0.4: v1(31.6,68.45) 25.88,74.17 v1(25.76,74.17)
3.4: length 60.6
  Top Layer w0.4: 36.81,58.55 arc(37.55,60.47) 39.47,61.21 44.05,61.21 U1.23 ; 36.81,58.67 36.81,25.65 33.12,21.97 编码器1.4
3.5: length 40.5
  Top Layer w0.4: 编码器1.3 arc(34.01,7.37) 34.39,8.25 34.39,21.34 39.35,26.29 39.35,36.2 arc(41,40.01) U1.26
3.6: length 20.1
  Bottom Layer w0.4: U1.27 arc(46.97,43.31) 46.08,42.93 TOF1.3
3.7: length 20.1
  Bottom Layer w0.4: U1.28 arc(46.97,40.77) 46.08,40.39 TOF1.4
4.0: length 17.1
  Bottom Layer w0.4: IMU660RA1.3 46.2,56.64 49.63,56.64 U1.18
4.1: length 13.9
  Top Layer w0.4: IMU660RA1.4 41.76,52.32 U1.29
4.2: length 20.3
  Top Layer w0.4: U1.30 arc(50.78,42.04) 51.16,42.93 51.16,45.59 41.89,54.86 IMU660RA1.5
4.3: length 20.2
  Top Layer w0.4: IMU660RA1.6 42.01,57.4 52.43,46.99 U1.31
4.5: length 15.8
  Top Layer w0.4: R15.2 v1(71.48,45.85)
  Bottom Layer w0.4: U1.41 arc(65.45,43.37) 66.27,43.05 70.62,43.05 arc(71.22,43.31) 71.48,43.91 v1(71.48,45.85)
5.0: length 30.1
  Top Layer w0.4: R2.2 68.44,55.12 v1(68.43,55.12)
  Bottom Layer w0.4: v1(68.43,55.12) 66.4,57.15 66.4,59.73 arc(66.08,60.52) 65.29,60.83 46.2,60.83 U1.24
5.1: length 32.5
  Top Layer w0.4: v1(60.05,52.7) 67.29,52.7 R3.2 ; v1(44.81,46.86) U1.25
  Bottom Layer w0.4: v1(60.05,52.7) 49.38,52.7 arc(46.14,51.37) 44.81,48.13 v1(44.81,46.86)
5.2: length 49.6
  Bottom Layer w0.4: U1.48 65.08,33.99 31.77,33.99 TOF1.5
5.3: length 58.6
  Bottom Layer w0.4: 编码器2.3 arc(67.03,7.37) 67.41,8.25 67.41,18.03 68.68,19.3 68.68,31.37 75.41,38.1 75.41,54.23 U1.4
$1N2280: length 27.8
  Top Layer w0.4: R2.1 74.4,53.85 80.62,60.07 80.62,65.43 SW3.1 SW3.2
$1N2281: length 20.1
  Top Layer w0.4: SW2.2 SW2.1 80.34,50.29 R3.1
$1N2282: length 33.2
  Top Layer w0.4: R4.1 74.4,55.88 79.35,60.83 79.35,71.76 81.84,74.25 SW1.1 SW1.2
$1N2283: length 22.8
  Top Layer w0.4: SW4.2 SW4.1 82.41,59.7 74.65,51.94 R5.1
$1N2297: length 11.3
  Top Layer w1.3: 33.11,93.59 27.57,88.04 R6.2
$1N2298: length 6
  Top Layer w0.6: Q2.3 22.84,90.81 25.51,93.48 25.51,93.98
$1N2299: length 3.6
  Top Layer w0.6: R7.2 24.16,84.64 Q2.1
$1N3556: length 15.5
  Top Layer w0.4: 电机pwm1.2 45.95,17.28 R13.1
$1N3560: length 19
  Top Layer w0.4: 电机pwm1.1 arc(46.84,7.37) 47.22,8.25 47.22,16.52 R11.2
$1N3578: length 18.9
  Top Layer w0.4: 电机pwm1.5 arc(52.3,7.49) 52.81,8.76 52.81,17.53 R12.2
$1N3591: length 15.3
  Top Layer w0.4: R14.1 51.03,17.79 电机pwm1.6
$1N3733: length 11.3
  Top Layer w0.4: R15.1 81.92,45.85 SW5.1 SW5.2

## Copper pours and planes (outline as drawn; the poured copper is in the pictures)
GND on Top Layer: -12.22,110.36 112.88,110.36 112.88,-6.35 -12.22,-6.35
GND on Bottom Layer: -19.58,115.57 121.26,115.57 121.26,-11.18 -19.58,-11.18
PGND on Top Layer: 81.64,14.48 83.06,14.48 83.06,11.05 81.64,11.05
VCCBAT on Top Layer: 12.17,45.72 26.01,45.72 26.01,1.65 12.17,1.65
VCCBAT on Top Layer: 11.91,14.86 21.57,14.86 21.57,9.91 11.91,9.91
VCCBAT on Bottom Layer: 15.6,8 82.91,8 82.91,0.38 15.6,0.38
VCCBAT on Bottom Layer: 78.46,14.99 91.16,14.99 91.16,1.78 78.46,1.78
VCCBAT on Bottom Layer: 12.42,89.54 36.55,89.54 36.55,37.79 12.42,37.79
$1N2243 on Top Layer: 6.58,56.99 12.42,56.99 12.42,43.69 6.58,43.69
$1N2244 on Top Layer: 14.83,60.45 16.1,60.45 16.1,56.13 14.83,56.13
$1N2244 on Top Layer: 7.6,61.09 16.79,61.09 16.79,58.15 7.6,58.15
$1N2245 on Top Layer: 6.83,70.87 20.9,70.87 20.9,57.88 6.83,57.88
$1N2245 on Top Layer: 6.45,50.47 11.66,50.47 11.66,39.24 6.45,39.24
$1N2245 on Top Layer: 8.99,59.82 20.93,59.82 20.93,48.64 8.99,48.64

Small or netless copper shapes (teardrops, artwork), in the pictures only: 106 on Top Layer, 26 on Bottom Layer

## Text on the board
Bottom Silkscreen Layer: G | 5V | VCC | VCCBAT | VCC_OP
Top Layer: 广东海洋大学第十九届智能车 | 2024年5月1日 | 陈东林 | 秋海棠队
Top Silkscreen Layer: 3.3V | 5V | G | 0.1 | 0.0 | 0.2 | 1.5 | 1.4 | 1.1 | 0.5 | - | + | VCCBAT | 3.4 | 3.5 | VCC | 2.4 | 1.0 | 2.6 | 1.3 | 0.6 | 5.3 | 0.4 | VCC_BM | 5V_BM | 1.6 | 5.0 | 4.5 | 5.1 | 1.7 | JLCJLCJLCJLC
